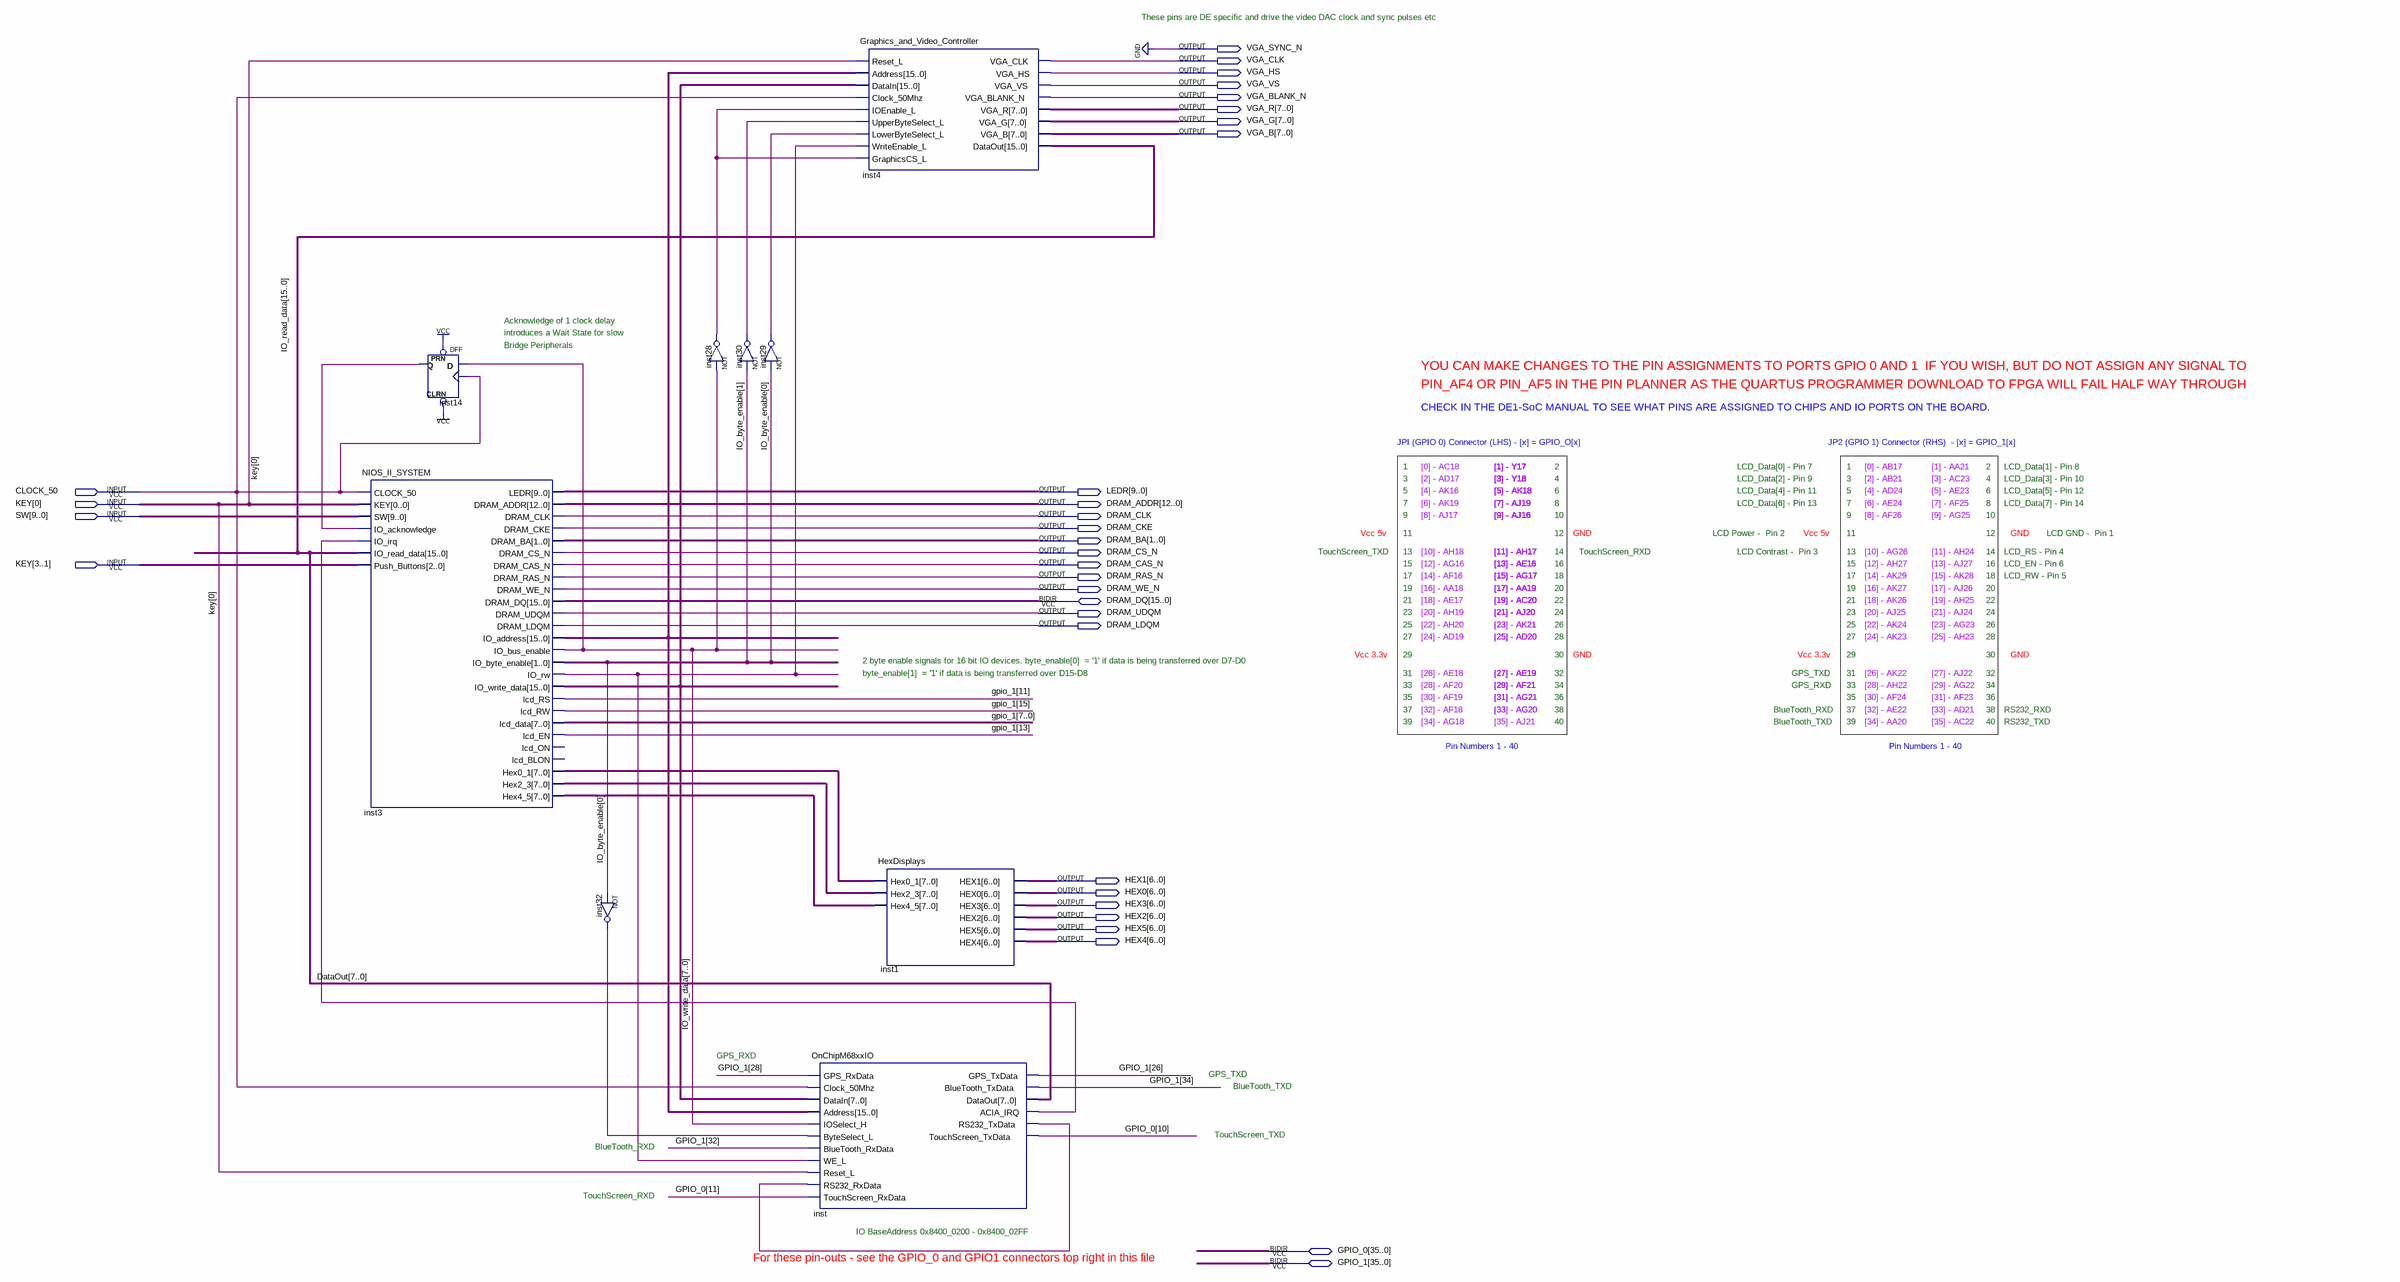
[diagram p0: schematic sheet]
// Quartus schematic Exercise17.bdf as structural Verilog: 9 symbols, 32 pins
module Exercise17 (
  input  CLOCK_50,
  input  [3:0] KEY,
  input  [9:0] SW,
  inout  [15:0] DRAM_DQ,
  inout  [35:0] GPIO_0,
  inout  [35:0] GPIO_1,
  output VGA_SYNC_N,
  output VGA_CLK,
  output VGA_HS,
  output VGA_VS,
  output VGA_BLANK_N,
  output [7:0] VGA_R,
  output [7:0] VGA_G,
  output [7:0] VGA_B,
  output [9:0] LEDR,
  output [12:0] DRAM_ADDR,
  output DRAM_CLK,
  output DRAM_CKE,
  output [1:0] DRAM_BA,
  output DRAM_CS_N,
  output DRAM_CAS_N,
  output DRAM_RAS_N,
  output DRAM_WE_N,
  output DRAM_UDQM,
  output DRAM_LDQM,
  output [6:0] HEX1,
  output [6:0] HEX0,
  output [6:0] HEX3,
  output [6:0] HEX2,
  output [6:0] HEX5,
  output [6:0] HEX4
);

  wire inst3_io_bus_enable, inst3_io_rw, inst14_q, inst28_out, inst29_out, inst30_out, inst32_out,
       inst_acia_irq, inst_rs232_txdata;
  wire [1:0] IO_byte_enable;
  wire [7:0] DataOut, inst3_hex0_1, inst3_hex2_3, inst3_hex4_5;
  wire [15:0] inst3_io_address, IO_read_data, IO_write_data;

  NIOS_II_SYSTEM inst3 (
    .CLOCK_50(CLOCK_50), .KEY(KEY[0]), .SW(SW), .IO_acknowledge(inst14_q), .IO_irq(inst_acia_irq),
    .IO_read_data(IO_read_data), .Push_Buttons(KEY[3:1]), .LEDR(LEDR), .DRAM_ADDR(DRAM_ADDR),
    .DRAM_CLK(DRAM_CLK), .DRAM_CKE(DRAM_CKE), .DRAM_BA(DRAM_BA), .DRAM_CS_N(DRAM_CS_N),
    .DRAM_CAS_N(DRAM_CAS_N), .DRAM_RAS_N(DRAM_RAS_N), .DRAM_WE_N(DRAM_WE_N), .DRAM_UDQM(DRAM_UDQM),
    .DRAM_LDQM(DRAM_LDQM), .IO_address(inst3_io_address), .IO_bus_enable(inst3_io_bus_enable),
    .IO_byte_enable(IO_byte_enable), .IO_rw(inst3_io_rw), .IO_write_data(IO_write_data), .lcd_RS(GPIO_1[11]),
    .lcd_RW(GPIO_1[15]), .lcd_EN(GPIO_1[13]), .Hex0_1(inst3_hex0_1), .Hex2_3(inst3_hex2_3),
    .Hex4_5(inst3_hex4_5), .DRAM_DQ(DRAM_DQ), .lcd_data(GPIO_1[7:0]));  // open: lcd_ON, lcd_BLON
  DFF inst14 (.CLRN(1'b1), .CLK(CLOCK_50), .D(inst3_io_bus_enable), .PRN(1'b1), .Q(inst14_q));
  not inst32 (inst32_out, IO_byte_enable[0]);
  not inst28 (inst28_out, inst3_io_bus_enable);
  not inst30 (inst30_out, IO_byte_enable[1]);
  not inst29 (inst29_out, IO_byte_enable[0]);
  OnChipM68xxIO inst (
    .GPS_RxData(GPIO_1[28]), .Clock_50Mhz(CLOCK_50), .DataIn(IO_write_data[7:0]), .Address(inst3_io_address),
    .IOSelect_H(inst3_io_bus_enable), .ByteSelect_L(inst32_out), .BlueTooth_RxData(GPIO_1[32]),
    .WE_L(inst3_io_rw), .Reset_L(KEY[0]), .RS232_RxData(inst_rs232_txdata), .TouchScreen_RxData(GPIO_0[11]),
    .GPS_TxData(GPIO_1[26]), .BlueTooth_TxData(GPIO_1[34]), .DataOut(DataOut), .ACIA_IRQ(inst_acia_irq),
    .RS232_TxData(inst_rs232_txdata), .TouchScreen_TxData(GPIO_0[10]));
  Graphics_and_Video_Controller inst4 (
    .Reset_L(KEY[0]), .Address(inst3_io_address), .DataIn(IO_write_data), .Clock_50Mhz(CLOCK_50),
    .IOEnable_L(inst28_out), .UpperByteSelect_L(inst30_out), .LowerByteSelect_L(inst29_out),
    .WriteEnable_L(inst3_io_rw), .GraphicsCS_L(inst28_out), .VGA_CLK(VGA_CLK), .VGA_HS(VGA_HS),
    .VGA_VS(VGA_VS), .VGA_BLANK_N(VGA_BLANK_N), .VGA_R(VGA_R), .VGA_G(VGA_G), .VGA_B(VGA_B),
    .DataOut(IO_read_data));
  HexDisplays inst1 (
    .Hex0_1(inst3_hex0_1), .Hex2_3(inst3_hex2_3), .Hex4_5(inst3_hex4_5), .HEX1(HEX1), .HEX0(HEX0),
    .HEX3(HEX3), .HEX2(HEX2), .HEX5(HEX5), .HEX4(HEX4));

  assign VGA_SYNC_N = 1'b0;

  // Notes on the sheet:
  //   These pins are DE specific and drive the video DAC clock and sync pulses etc
  //   Acknowledge of 1 clock delay
  //   introduces a Wait State for slow
  //   Bridge Peripherals
  //   YOU CAN MAKE CHANGES TO THE PIN ASSIGNMENTS TO PORTS GPIO 0 AND 1  IF YOU WISH, BUT DO NOT ASSIGN ANY SIGNAL TO 
  //   PIN_AF4 OR PIN_AF5 IN THE PIN PLANNER AS THE QUARTUS PROGRAMMER DOWNLOAD TO FPGA WILL FAIL HALF WAY THROUGH
  //   CHECK IN THE DE1-SoC MANUAL TO SEE WHAT PINS ARE ASSIGNED TO CHIPS AND IO PORTS ON THE BOARD. 
  //   JPI (GPIO 0) Connector (LHS) - [x] = GPIO_O[x]
  //   JP2 (GPIO 1) Connector (RHS)  - [x] = GPIO_1[x]
  //   1
  //   [0] - AC18
  //   [1] - Y17
  //   [1] - Y17
  //   [1] - Y17
  //   [1] - Y17
  //   [1] - Y17
  //   [1] - Y17
  //   [1] - Y17
  //   [1] - Y17
  //   [1] - Y17
  //   [1] - Y17
  //   [1] - Y17
  //   [1] - Y17
  //   [1] - Y17
  //   [1] - Y17
  //   [1] - Y17
  //   [1] - Y17
  //   [1] - Y17
  //   [1] - Y17
  //   [1] - Y17
  //   2
  //   LCD_Data[0] - Pin 7
  //   1
  //   [0] - AB17
  //   [1] - AA21
  //   2
  //   LCD_Data[1] - Pin 8
  //   3
  //   [2] - AD17
  //   [3] - Y18
  //   [3] - Y18
  //   [3] - Y18
  //   [3] - Y18
  //   [3] - Y18
  //   [3] - Y18
  //   [3] - Y18
  //   [3] - Y18
  //   [3] - Y18
  //   [3] - Y18
  //   [3] - Y18
  //   [3] - Y18
  //   [3] - Y18
  //   [3] - Y18
  //   [3] - Y18
  //   [3] - Y18
  //   [3] - Y18
  //   [3] - Y18
  //   4
  //   LCD_Data[2] - Pin 9
  //   3
  //   [2] - AB21
  //   [3] - AC23
  //   4
  //   LCD_Data[3] - Pin 10
  //   5
  //   [4] - AK16
  //   [5] - AK18
  //   [5] - AK18
  //   [5] - AK18
  //   [5] - AK18
  //   [5] - AK18
  //   [5] - AK18
  //   [5] - AK18
  //   [5] - AK18
  //   [5] - AK18
  //   [5] - AK18
  //   [5] - AK18
  //   [5] - AK18
  //   [5] - AK18
  //   [5] - AK18
  //   [5] - AK18
  //   [5] - AK18
  //   6
  //   LCD_Data[4] - Pin 11
  //   5
  //   [4] - AD24
  //   [5] - AE23
  //   6
  //   LCD_Data[5] - Pin 12
  //   7
  //   [6] - AK19
  //   [7] - AJ19
  //   [7] - AJ19
  //   [7] - AJ19
  //   [7] - AJ19
  //   [7] - AJ19
  //   [7] - AJ19
  //   [7] - AJ19
  //   [7] - AJ19
  //   [7] - AJ19
  //   [7] - AJ19
  //   [7] - AJ19
  //   [7] - AJ19
  //   [7] - AJ19
  //   [7] - AJ19
  //   8
  //   LCD_Data[6] - Pin 13
  //   7
  //   [6] - AE24
  //   [7] - AF25
  //   8
  //   LCD_Data[7] - Pin 14
  //   9
  //   [8] - AJ17
  //   [9] - AJ16
  //   [9] - AJ16
  //   [9] - AJ16
  //   [9] - AJ16
  //   [9] - AJ16
  //   [9] - AJ16
  //   [9] - AJ16
  //   [9] - AJ16
  //   [9] - AJ16
  //   [9] - AJ16
  //   [9] - AJ16
  //   [9] - AJ16
  //   [9] - AJ16
  //   10
  //   9
  //   [8] - AF26
  //   [9] - AG25
  //   10
  //   Vcc 5v
  //   11
  //   12
  //   GND
  //   LCD Power -  Pin 2
  //   Vcc 5v
  //   11
  //   12
  //   GND
  //   LCD GND -  Pin 1
  //   TouchScreen_TXD
  //   13
  //   [10] - AH18
  //   [11] - AH17
  //   [11] - AH17
  //   [11] - AH17
  //   [11] - AH17
  //   [11] - AH17
  //   [11] - AH17
  //   [11] - AH17
  //   [11] - AH17
  //   [11] - AH17
  //   [11] - AH17
  //   [11] - AH17
  //   [11] - AH17
  //   14
  //   TouchScreen_RXD
  //   LCD Contrast -  Pin 3
  //   13
  //   [10] - AG26
  //   [11] - AH24
  //   14
  //   LCD_RS - Pin 4
  //   15
  //   [12] - AG16
  //   [13] - AE16
  //   [13] - AE16
  //   [13] - AE16
  //   [13] - AE16
  //   [13] - AE16
  //   [13] - AE16
  //   [13] - AE16
  //   [13] - AE16
  //   [13] - AE16
  //   [13] - AE16
  //   [13] - AE16
  //   16
  //   15
  //   [12] - AH27
  //   [13] - AJ27
  //   16
  //   LCD_EN - Pin 6
  //   17
  //   [14] - AF16
  //   [15] - AG17
  //   [15] - AG17
  //   [15] - AG17
  //   [15] - AG17
  //   [15] - AG17
  //   [15] - AG17
  //   [15] - AG17
  //   [15] - AG17
  //   [15] - AG17
  //   18
  //   17
  //   [14] - AK29
  //   [15] - AK28
  //   18
  //   LCD_RW - Pin 5
  //   19
  //   [16] - AA18
  //   [17] - AA19
  //   [17] - AA19
  //   [17] - AA19
  //   [17] - AA19
  //   [17] - AA19
  //   [17] - AA19
  //   [17] - AA19
  //   [17] - AA19
  //   [17] - AA19
  //   [17] - AA19
  //   20
  //   19
  //   [16] - AK27
  //   [17] - AJ26
  //   20
  //   21
  //   [18] - AE17
  //   [19] - AC20
  //   [19] - AC20
  //   [19] - AC20
  //   [19] - AC20
  //   [19] - AC20
  //   [19] - AC20
  //   [19] - AC20
  //   [19] - AC20
  //   22
  //   21
  //   [18] - AK26
  //   [19] - AH25
  //   22
  //   23
  //   [20] - AH19
  //   [21] - AJ20
  //   [21] - AJ20
  //   [21] - AJ20
  //   [21] - AJ20
  //   [21] - AJ20
  //   [21] - AJ20
  //   [21] - AJ20
  //   24
  //   23
  //   [20] - AJ25
  //   [21] - AJ24
  //   24
  //   25
  //   [22] - AH20
  //   [23] - AK21
  //   [23] - AK21
  //   26
  //   25
  //   [22] - AK24
  //   [23] - AG23
  //   26
  //   27
  //   [24] - AD19
  //   [25] - AD20
  //   [25] - AD20
  //   [25] - AD20
  //   28
  //   27
  //   [24] - AK23
  //   [25] - AH23
  //   28
  //   Vcc 3.3v
  //   29
  //   30
  //   GND
  //   Vcc 3.3v
  //   29
  //   30
  //   GND
  //   2 byte enable signals for 16 bit IO devices. byte_enable[0]  = '1' if data is being transferred over D7-D0
  //   byte_enable[1]  = '1' if data is being transferred over D15-D8
  //   31
  //   [26] - AE18
  //   [27] - AE19
  //   [27] - AE19
  //   [27] - AE19
  //   [27] - AE19
  //   [27] - AE19
  //   32
  //   GPS_TXD
  //   31
  //   [26] - AK22
  //   [27] - AJ22
  //   32
  //   33
  //   [28] - AF20
  //   [29] - AF21
  //   [29] - AF21
  //   [29] - AF21
  //   [29] - AF21
  //   34
  //   GPS_RXD
  //   33
  //   [28] - AH22
  //   [29] - AG22
  //   34
  //   35
  //   [30] - AF19
  //   [31] - AG21
  //   [31] - AG21
  //   [31] - AG21
  //   36
  //   35
  //   [30] - AF24
  //   [31] - AF23
  //   36
  //   37
  //   [32] - AF18
  //   [33] - AG20
  //   [33] - AG20
  //   38
  //   BlueTooth_RXD
  //   37
  //   [32] - AE22
  //   [33] - AD21
  //   38
  //   RS232_RXD
  //   39
  //   [34] - AG18
  //   [35] - AJ21
  //   40
  //   BlueTooth_TXD
  //   39
  //   [34] - AA20
  //   [35] - AC22
  //   40
  //   RS232_TXD
  //   Pin Numbers 1 - 40
  //   Pin Numbers 1 - 40
  //   GPS_RXD
  //   GPS_TXD
  //   BlueTooth_TXD
  //   TouchScreen_TXD
  //   BlueTooth_RXD
  //   TouchScreen_RXD
  //   IO BaseAddress 0x8400_0200 - 0x8400_02FF
  //   For these pin-outs - see the GPIO_0 and GPIO1 connectors top right in this file
endmodule
